# Altium project STLINK_Breakout.PrjPcb
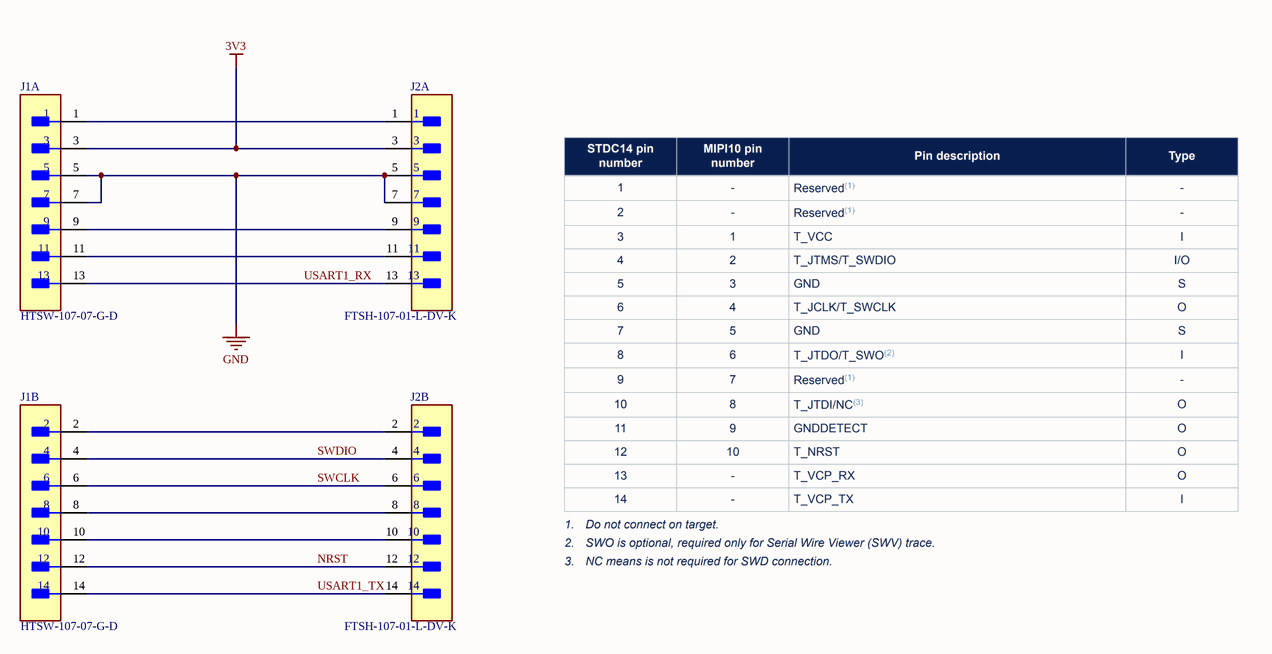
[diagram p0: STLINK_Breakout.SchDoc]
1 sheet, 2 parts. Net scope: global (net labels, ports and power ports of the same name join across sheets).
Board file: STLINK_Breakout.PcbDoc

## Sheet STLINK_Breakout.SchDoc: STLINK Breakout Board
size A4; Revision: 1; SheetNumber: 1; SheetTotal: 1

### Parts
J1  HTSW-107-07-G-D  [FP-HTSW-107-07-G-D-MFG]  (parts A,B of 2)
J2  FTSH-107-01-L-DV-K  [FP-FTSH-107-01-L-DV-K-MFG]  (parts A,B of 2)

### Nets
3V3: J1.3 J2.3
GND: J1.5 J1.7 J2.5 J2.7
NRST: J1.12 J2.12
SWCLK: J1.6 J2.6
SWDIO: J1.4 J2.4
USART1_RX: J1.13 J2.13
USART1_TX: J1.14 J2.14
NetJ1_1: J1.1 J2.1
NetJ1_2: J1.2 J2.2
NetJ1_8: J1.8 J2.8
NetJ1_9: J1.9 J2.9
NetJ1_10: J1.10 J2.10
NetJ1_11: J1.11 J2.11

### Library data of the parts
J1 = CMP-02766-001774-1: CONN HEADER VERT 14POS 2.54MM; Max Current Rating: 7A; Gender: Male; Max Voltage Rating (AC): 550V; Number of Contacts: 14; Contact Type: Male Pin; Pitch: 2.54mm; Connector Type: Header; Termination: Solder; Reach SVHC Compliant: Yes; Depth: 5.02mm; Length: 17.78mm; Insulation Color: Natural; Insulation Material: Polymer; Housing Color: Natural; Flammability Rating: UL94 V-0; Housing Material: Polymer; Contact Material: Bronze; Fastening Type: Pull; Number of Rows: 2; Orientation: Straight; Min Operating Temperature: -55°C; RoHS Compliant: Yes; Series: HTSW; Contact Plating: Gold; Contact Finish - Mating: GOLD; Number of Positions: 14; Packaging: Bag; Max Operating Temperature: 125°C; Contact Shape: Square
J2 = CMP-02766-001412-1: CONN HEADER SMD 14POS 1.27MM; Number of Contacts: 14; Gender: Male; Termination: Solder; Lead Free: Lead Free; Depth: 5.84mm; Min Operating Temperature: -55°C; Length: 8.89mm; RoHS Compliant: Yes; Housing Material: Polymer; Housing Color: Black; Max Operating Temperature: 125°C; Number of Rows: 2; Pitch: 1.27mm; Radiation Hardening: No; Orientation: Straight; Packaging: Rail/Tube; Contact Material: Bronze; Contact Plating: Gold